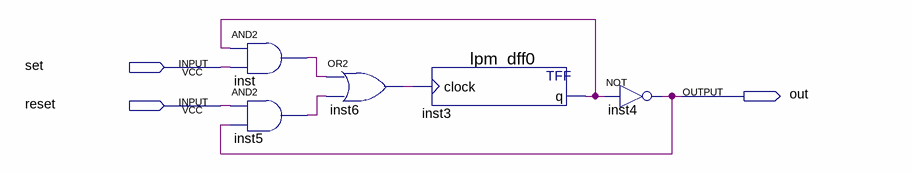
[diagram p0: schematic sheet]
// Quartus schematic RS-trigger.bdf as structural Verilog: 5 symbols, 3 pins
module \RS-trigger  (
  input  set,
  input  reset,
  output out
);

  wire inst3_q, inst5_out, inst6_out, inst_out;

  and inst (inst_out, inst3_q, set);
  and inst5 (inst5_out, reset, out);
  or inst6 (inst6_out, inst_out, inst5_out);
  lpm_dff0 inst3 (.clock(inst6_out), .q(inst3_q));
  not inst4 (out, inst3_q);
endmodule
